# Altium schematic sheet Altium_fpga.SchDoc
size A4
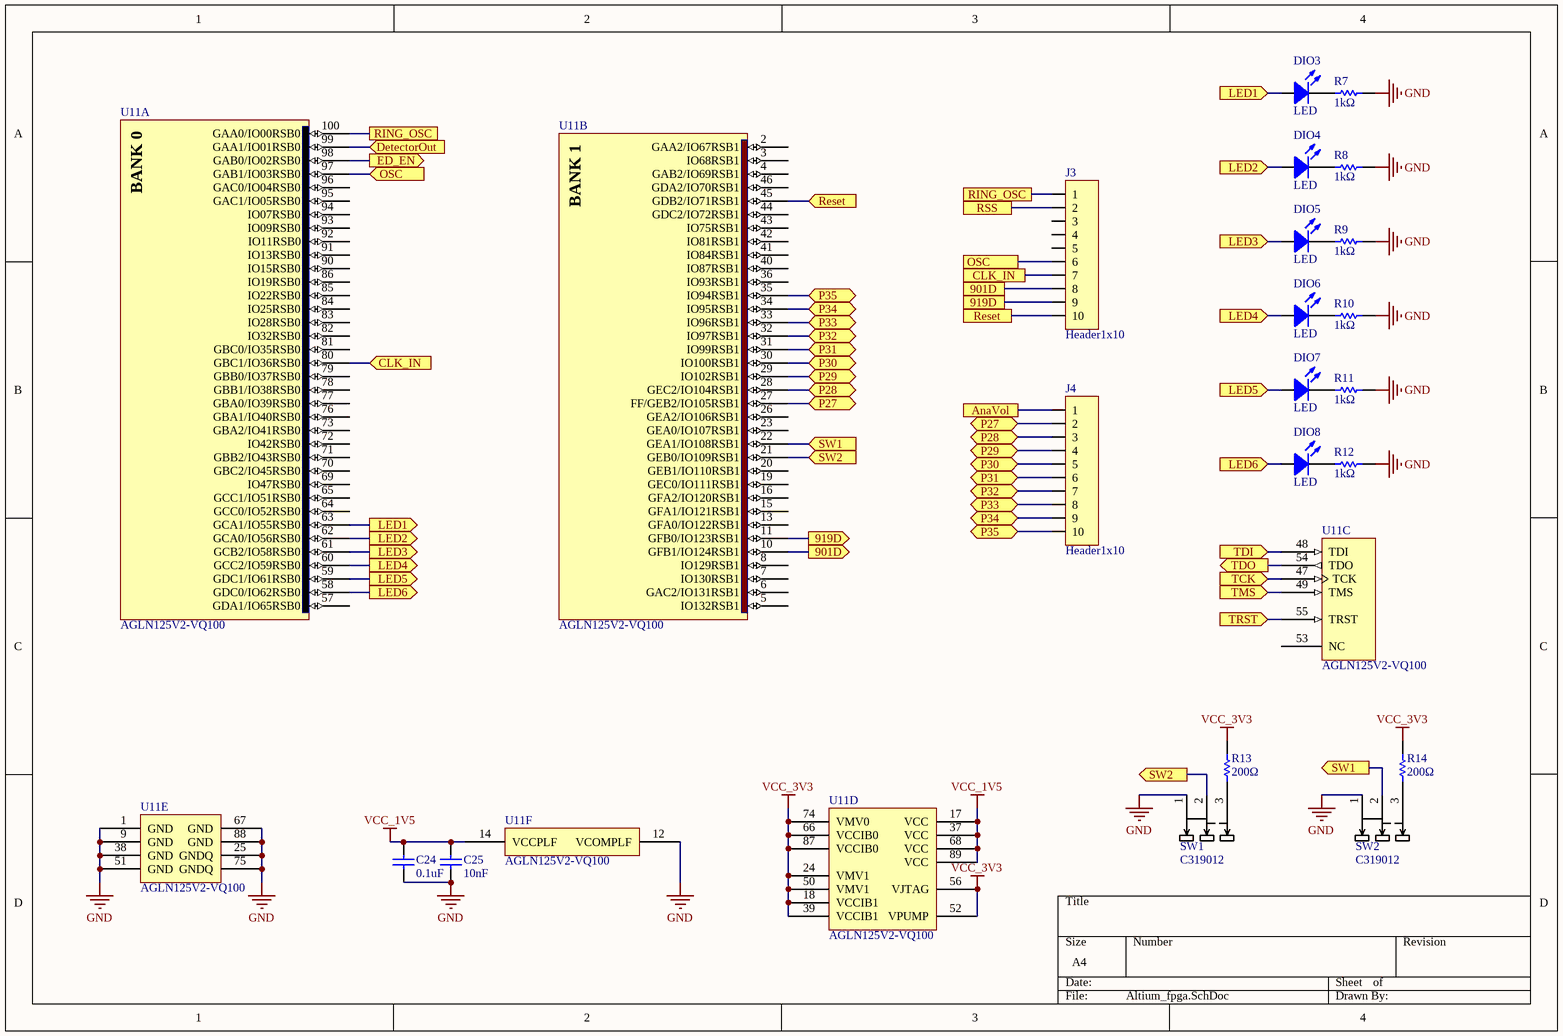
[diagram p0: Altium_fpga.SchDoc]

## Parts
C24  0.1uF  [C0603]
C25  10nF  [C0603]
DIO3  LED  [LED0603]
DIO4  LED  [LED0603]
DIO5  LED  [LED0603]
DIO6  LED  [LED0603]
DIO7  LED  [LED0603]
DIO8  LED  [LED0603]
J3  Header1x10  [Header1x10]
J4  Header1x10  [Header1x10]
R7  1kΩ  [R0603]
R8  1kΩ  [R0603]
R9  1kΩ  [R0603]
R10  1kΩ  [R0603]
R11  1kΩ  [R0603]
R12  1kΩ  [R0603]
R13  200Ω  [R0603]
R14  200Ω  [R0603]
SW1  C319012  [C319012]
SW2  C319012  [C319012]
U11  AGLN125V2-VQ100  [VQ100_N]  (parts A,B,C,D,E,F of 6)

## Ports
901D, 901D (out), 919D, 919D (out), AnaVol, CLK_IN, CLK_IN (in), DetectorOut (in), ED_EN (out), LED1 (in), LED1 (out), LED2 (in), LED2 (out), LED3 (in), LED3 (out), LED4 (in), LED4 (out), LED5 (in), LED5 (out), LED6 (in), LED6 (out), OSC, OSC (in), P27 (bidir), P28 (bidir), P29 (bidir), P30 (bidir), P31 (bidir), P32 (bidir), P33 (bidir), P34 (bidir), P35 (bidir), Reset, Reset (in), RING_OSC, RSS, SW1 (in), SW1 (out), SW2 (in), SW2 (out), TCK (in), TDI (in), TDO (out), TMS (in), TRST (in)

## Nets
GND: C24.2 C25.2 R7.1 R8.1 R9.1 R10.1 R11.1 R12.1 SW1.1 SW2.1 U11.1(GND) U11.9(GND) U11.12(VCOMPLF) U11.25(GNDQ) U11.38(GND) U11.51(GND) U11.67(GND) U11.75(GNDQ) U11.88(GND)
VCC_1V5: C24.1 C25.1 U11.14(VCCPLF) U11.17(VCC) U11.37(VCC) U11.68(VCC) U11.89(VCC)
VCC_3V3: R13.1 R14.1 U11.18(VCCIB1) U11.24(VMV1) U11.39(VCCIB1) U11.50(VMV1) U11.52(VPUMP) U11.56(VJTAG) U11.66(VCCIB0) U11.74(VMV0) U11.87(VCCIB0)
901D: J3.8 U11.10(GFB1/IO124RSB1) ; port 901D
919D: J3.9 U11.11(GFB0/IO123RSB1) ; port 919D
AnaVol: J4.1 ; port AnaVol
CLK_IN: J3.7 U11.80(GBC1/IO36RSB0) ; port CLK_IN
DetectorOut: U11.99(GAA1/IO01RSB0) ; port DetectorOut
ED_EN: U11.98(GAB0/IO02RSB0) ; port ED_EN
LED1: DIO3.1 U11.63(GCA1/IO55RSB0) ; port LED1
LED2: DIO4.1 U11.62(GCA0/IO56RSB0) ; port LED2
LED3: DIO5.1 U11.61(GCB2/IO58RSB0) ; port LED3
LED4: DIO6.1 U11.60(GCC2/IO59RSB0) ; port LED4
LED5: DIO7.1 U11.59(GDC1/IO61RSB0) ; port LED5
LED6: DIO8.1 U11.58(GDC0/IO62RSB0) ; port LED6
OSC: J3.6 U11.97(GAB1/IO03RSB0) ; port OSC
P27: J4.2 U11.27(FF/GEB2/IO105RSB1) ; port P27
P28: J4.3 U11.28(GEC2/IO104RSB1) ; port P28
P29: J4.4 U11.29(IO102RSB1) ; port P29
P30: J4.5 U11.30(IO100RSB1) ; port P30
P31: J4.6 U11.31(IO99RSB1) ; port P31
P32: J4.7 U11.32(IO97RSB1) ; port P32
P33: J4.8 U11.33(IO96RSB1) ; port P33
P34: J4.9 U11.34(IO95RSB1) ; port P34
P35: J4.10 U11.35(IO94RSB1) ; port P35
Reset: J3.10 U11.45(GDB2/IO71RSB1) ; port Reset
RING_OSC: J3.1 U11.100(GAA0/IO00RSB0) ; port RING_OSC
RSS: J3.2 ; port RSS
SW1: SW2.2 U11.22(GEA1/IO108RSB1) ; port SW1
SW2: SW1.2 U11.21(GEB0/IO109RSB1) ; port SW2
TCK: U11.47(TCK) ; port TCK
TDI: U11.48(TDI) ; port TDI
TDO: U11.54(TDO) ; port TDO
TMS: U11.49(TMS) ; port TMS
TRST: U11.55(TRST) ; port TRST
NetDIO3_2: DIO3.2 R7.2
NetDIO4_2: DIO4.2 R8.2
NetDIO5_2: DIO5.2 R9.2
NetDIO6_2: DIO6.2 R10.2
NetDIO7_2: DIO7.2 R11.2
NetDIO8_2: DIO8.2 R12.2
NetR13_2: R13.2 SW1.3
NetR14_2: R14.2 SW2.3

Not connected (* = marked no-connect by the designer): J3 3 4 5; U11 2(GAA2/IO67RSB1) 3(IO68RSB1) 4(GAB2/IO69RSB1) 5(IO132RSB1) 6(GAC2/IO131RSB1) 7(IO130RSB1) 8(IO129RSB1) 13(GFA0/IO122RSB1) 15(GFA1/IO121RSB1) 16(GFA2/IO120RSB1) 19(GEC0/IO111RSB1) 20(GEB1/IO110RSB1) 23(GEA0/IO107RSB1) 26(GEA2/IO106RSB1) 36(IO93RSB1) 40(IO87RSB1) 41(IO84RSB1) 42(IO81RSB1) 43(IO75RSB1) 44(GDC2/IO72RSB1) 46(GDA2/IO70RSB1) 53(NC) 57(GDA1/IO65RSB0) 64(GCC0/IO52RSB0) 65(GCC1/IO51RSB0) 69(IO47RSB0) 70(GBC2/IO45RSB0) 71(GBB2/IO43RSB0) 72(IO42RSB0) 73(GBA2/IO41RSB0) 76(GBA1/IO40RSB0) 77(GBA0/IO39RSB0) 78(GBB1/IO38RSB0) 79(GBB0/IO37RSB0) 81(GBC0/IO35RSB0) 82(IO32RSB0) 83(IO28RSB0) 84(IO25RSB0) 85(IO22RSB0) 86(IO19RSB0) 90(IO15RSB0) 91(IO13RSB0) 92(IO11RSB0) 93(IO09RSB0) 94(IO07RSB0) 95(GAC1/IO05RSB0) 96(GAC0/IO04RSB0)

## Notes on the sheet
- (in symbol AGLN125V2-VQ100, part A) BANK 0
- (in symbol AGLN125V2-VQ100, part B) BANK 1

## Library data of the parts
C24 C25 = Cap
R7-R14 = Res
U11 = AGLN125V2-VQ100: IGLOO nano Low-Power Flash 1.2 to 1.5V FPGA with Flash*Freeze, 71 User IOs, 125K System Gates, 1Kbit Flash ROM, 100-Pin TQFP, Commercial Grade; DatasheetVersion: rev11, Jul-2010; PackageVersion: rev40, Jun-2011; PackageReference: VQ100; PackageDescription: 100-Pin Plastic Quad Flat Pack (VQ100); Code_JEDEC: MS-026-AED; ComponentLink1Description: Manufacturer URL; ComponentLink1URL: http://www.actel.com/; ComponentLink2Description: IGLOO nano Datasheet; ComponentLink2URL: http://www.actel.com/documents/IGLOO_nano_DS.pdf; ComponentLink3Description: Package Mechanical Drawings; ComponentLink3URL: http://www.actel.com/documents/PckgMechDrwngs.pdf; ComponentLink4Description: IGLOO nano Documents; ComponentLink4URL: http://www.actel.com/products/igloonano/docs.aspx